# EAGLE design Becca Sap Flow Power Board MOD (EAGLE 9.6.2)
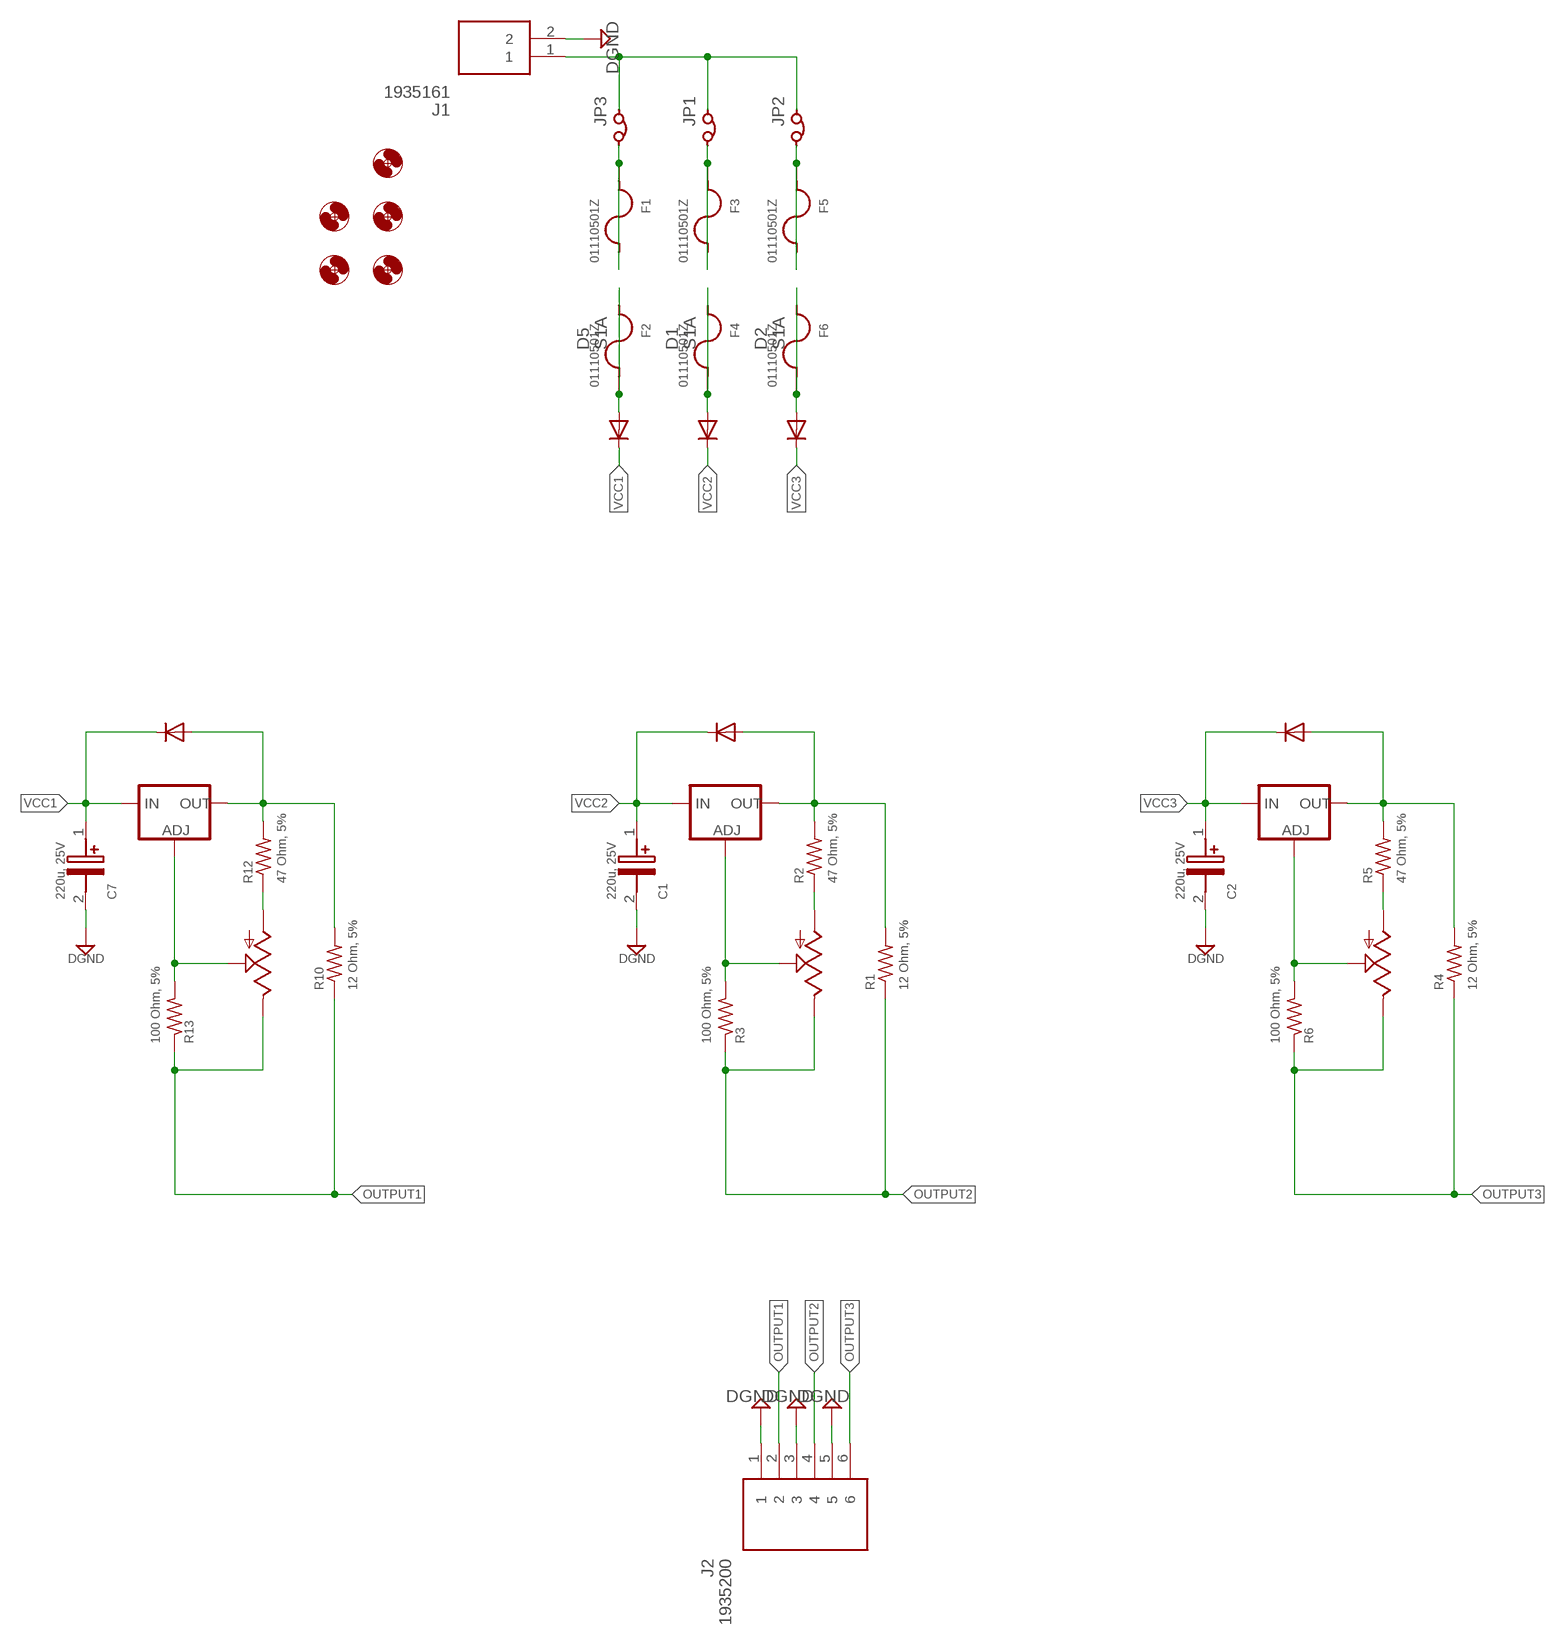
[diagram p0: schematic, sheet 1]

## Parts
C1  220u, 25V  UWT1E221MNL1GS  [CAPAE830X1080N]
C2  220u, 25V  UWT1E221MNL1GS  [CAPAE830X1080N]
C7  220u, 25V  UWT1E221MNL1GS  [CAPAE830X1080N]
D1  S1A  [DIOM5027X250N]
D2  S1A  [DIOM5027X250N]
D3  S1A  [DIOM5027X250N]
D4  S1A  [DIOM5027X250N]
D5  S1A  [DIOM5027X250N]
D6  S1A  [DIOM5027X250N]
F1  01110501Z  [01110501Z]
F2  01110501Z  [01110501Z]
F3  01110501Z  [01110501Z]
F4  01110501Z  [01110501Z]
F5  01110501Z  [01110501Z]
F6  01110501Z  [01110501Z]
J1  1935161  [1935161]
J2  1935200  [1935200]
JP1  JUMPER  [HDR2X1]
JP2  JUMPER  [HDR2X1]
JP3  JUMPER  [HDR2X1]
R1  12 Ohm, 5%  R-US_R1210  [R1210]
R2  47 Ohm, 5%  R-US_R1210  [R1210]
R3  100 Ohm, 5%  R-US_R1210  [R1210]
R4  12 Ohm, 5%  R-US_R1210  [R1210]
R5  47 Ohm, 5%  R-US_R1210  [R1210]
R6  100 Ohm, 5%  R-US_R1210  [R1210]
R10  12 Ohm, 5%  R-US_R1210  [R1210]
R12  47 Ohm, 5%  R-US_R1210  [R1210]
R13  100 Ohm, 5%  R-US_R1210  [R1210]
U1  LM317MBSTT3G  [SOT230P700X175-4N]
U2  LM317MBSTT3G  [SOT230P700X175-4N]
U3  LM317MBSTT3G  [SOT230P700X175-4N]
U$1  MOUNT-HOLE3.0  [3,0]
U$2  MOUNT-HOLE3.0  [3,0]
U$3  MOUNT-HOLE3.0  [3,0]
U$4  MOUNT-HOLE3.0  [3,0]
U$5  MOUNT-HOLE3.0  [3,0]
VR1  3296W-1-102RLF  [3296W1102RLF]
VR2  3296W-1-102RLF  [3296W1102RLF]
VR3  3296W-1-102RLF  [3296W1102RLF]

## Nets
DGND: C1.2(-) C2.2(-) C7.2(-) J1.2 J2.1 J2.3 J2.5
N$1: J1.1 JP1.1 JP2.1 JP3.1
N$2: D3.2(A) R1.2 R2.2 U2.2(OUT)
N$3: F1.1 F1.2 JP3.2
N$4: F3.1 F3.2 JP1.2
N$5: D5.2(A) F2.1 F2.2
N$6: D1.2(A) F4.1 F4.2
N$7: R3.2 U2.1(ADJ) VR2.2(S)
N$8: F5.1 F5.2 JP2.2
N$9: D2.2(A) F6.1 F6.2
N$10: R2.1 VR2.1(A)
N$11: D4.2(A) R4.2 R5.2 U3.2(OUT)
N$12: D6.2(A) R10.2 R12.2 U1.2(OUT)
N$13: R6.2 U3.1(ADJ) VR3.2(S)
N$14: R13.2 U1.1(ADJ) VR1.2(S)
N$15: R12.1 VR1.1(A)
N$16: R5.1 VR3.1(A)
OUTPUT1: J2.2 R10.1 R13.1 VR1.3(E)
OUTPUT2: J2.4 R1.1 R3.1 VR2.3(E)
OUTPUT3: J2.6 R4.1 R6.1 VR3.3(E)
VCC1: C7.1(+) D5.1(K) D6.1(K) U1.3(IN)
VCC2: C1.1(+) D1.1(K) D3.1(K) U2.3(IN)
VCC3: C2.1(+) D2.1(K) D4.1(K) U3.3(IN)

## Library data of the parts
C1 C2 C7 = Becca-Sap-Flow-LORA:UWT1E221MNL1GS: NICHICON - UWT1E221MNL1GS - ALUMINUM ELECTROLYTIC CAPACITOR 220UF 25V 20%, SMD Source: Datasheet <http://www.nichicon.co.jp/english/products/pdfs/e-uwt.pdf>; DESCRIPTION: NICHICON - UWT1E221MNL1GS - ALUMINUM ELECTROLYTIC CAPACITOR 220UF 25V 20%, SMD; HEIGHT: 10.8mm; MANUFACTURER_NAME: Nichicon; MANUFACTURER_PART_NUMBER: UWT1E221MNL1GS; MOUSER_PART_NUMBER: 647-UWT1E221MNL1GS; MOUSER_PRICE-STOCK: https://www.mouser.co.uk/ProductDetail/Nichicon/UWT1E221MNL1GS?qs=9nXXK2icEIxMJgFBHlqiZQ%3D%3D
D1-D6 = Becca-Sap-Flow-LORA:S1A: Rectifier Diode Switching 50V 1A 1500ns 2-Pin SMA T/R Source: Datasheet <https://diotec.com/request/datasheet/s1a.pdf>; DESCRIPTION: Rectifier Diode Switching 50V 1A 1500ns 2-Pin SMA T/R; HEIGHT: 2.5mm; MANUFACTURER_NAME: Diotec; MANUFACTURER_PART_NUMBER: S1A; MOUSER_PART_NUMBER: 637-S1A; MOUSER_PRICE-STOCK: https://www.mouser.co.uk/ProductDetail/Diotec-Semiconductor/S1A?qs=OlC7AqGiEDlqVjQP70PTqA%3D%3D
F1-F6 = Becca-Sap-Flow-LORA:01110501Z: Littelfuse 111 Spring Brass PCB Mount Fuse Clip for 2AG mm, 4.5 5 mm Cartridge Fuse Source: Datasheet <https://m.littelfuse.com/~/media/electronics/datasheets/fuse_clips/littelfuse_fuse_clip_111_datasheet.pdf.pdf>; DESCRIPTION: Littelfuse 111 Spring Brass PCB Mount Fuse Clip for 2AG mm, 4.5 5 mm Cartridge Fuse; HEIGHT: 7mm; MANUFACTURER_NAME: LITTELFUSE; MANUFACTURER_PART_NUMBER: 01110501Z; MOUSER_PART_NUMBER: 576-01110501Z; MOUSER_PRICE-STOCK: https://www.mouser.co.uk/ProductDetail/Littelfuse/01110501Z?qs=Ql%252B1sS8nYriZVK%2FyEjYMGg%3D%3D
J1 = Becca-Sap-Flow-LORA:1935161: Phoenix Contact COMBICON PT PCB Terminal Block, 2 Way/Pole, Screw Terminals, 26 14 AWG Through Hole, Nylon Source: Datasheet <https://datasheet.datasheetarchive.com/originals/distributors/SFDatasheet-2/sf-00057459.pdf>; DESCRIPTION: Phoenix Contact COMBICON PT PCB Terminal Block, 2 Way/Pole, Screw Terminals, 26 14 AWG Through Hole, Nylon; HEIGHT: 11.55mm; MANUFACTURER_NAME: Phoenix Contact; MANUFACTURER_PART_NUMBER: 1935161; MOUSER_PART_NUMBER: 651-1935161; MOUSER_PRICE-STOCK: https://www.mouser.co.uk/ProductDetail/Phoenix-Contact/1935161?qs=W3wJikR1%252BS6eKzfFl8Rbew%3D%3D
J2 = Becca-Sap-Flow-LORA:1935200: Fixed Terminal Blocks PT 1.5/6-5.0-H Source: Datasheet <https://datasheet.datasheetarchive.com/originals/distributors/SFDatasheet-2/sf-00057463.pdf>; DESCRIPTION: Fixed Terminal Blocks PT 1.5/6-5.0-H; HEIGHT: 11.55mm; MANUFACTURER_NAME: Phoenix Contact; MANUFACTURER_PART_NUMBER: 1935200; MOUSER_PART_NUMBER: 651-1935200; MOUSER_PRICE-STOCK: https://www.mouser.co.uk/ProductDetail/Phoenix-Contact/1935200?qs=8BCRtFWWXOTOyOTMiNRITA%3D%3D
JP1-JP3 = Becca-Sap-Flow-LORA:JUMPER: Wire jumper .1" C
R1-R6 R10 R12 R13 = Becca-Sap-Flow-LORA:R-US_: RESISTOR, American symbol; SPICEPREFIX: R
U1-U3 = Becca-Sap-Flow-LORA:LM317MBSTT3G: Internal Short Circuit Current Limiting; Internal Thermal Overload Protection; Output Current in Excess of 500 mA; Output Transistor Safe-Area Compensation; Output Adjustable between 1.2 V and 37 V; Floating Operation for High Voltage Applications; Eliminates Stocking Many Fixed Voltages; Pb-Free Packages are Available; NCV Prefix for Automotive and Other Applications Requiring Site Control Changes Source: Datasheet <https://www.onsemi.com/pub/Collateral/LM317M-D.PDF>; DESCRIPTION: Internal Short Circuit Current Limiting; Internal Thermal Overload Protection; Output Current in Excess of 500 mA; Output Transistor Safe-Area Compensation; Output Adjustable between 1.2 V and 37 V; Floating Operation for High Voltage Applications; Eliminates Stocking Many Fixed Voltages; Pb-Free Packages are Available; NCV Prefix for Automotive and Other Applications Requiring Site Control Changes; HEIGHT: 1.75mm; MANUFACTURER_NAME: onsemi; MANUFACTURER_PART_NUMBER: LM317MBSTT3G; MOUSER_PART_NUMBER: 863-LM317MBSTT3G; MOUSER_PRICE-STOCK: https://www.mouser.co.uk/ProductDetail/onsemi/LM317MBSTT3G?qs=2OtswVQKCOFxsFzIc5DGlw%3D%3D
U$1-U$5 = Becca-Sap-Flow-LORA:MOUNT-HOLE: MOUNTING HOLE with drill center marker
VR1-VR3 = Becca-Sap-Flow-LORA:3296W-1-102RLF: 1 kOhms 0.5W, 1/2W PC Pins Through Hole Trimmer Potentiometer Cermet 25.0 Turn Top Adjustment Source: Datasheet <https://www.bourns.com/docs/Product-Datasheets/3296.pdf>; DESCRIPTION: 1 kOhms 0.5W, 1/2W PC Pins Through Hole Trimmer Potentiometer Cermet 25.0 Turn Top Adjustment; HEIGHT: 11.8mm; MANUFACTURER_NAME: Bourns; MANUFACTURER_PART_NUMBER: 3296W-1-102RLF; MOUSER_PART_NUMBER: 652-3296W-1-102RLF; MOUSER_PRICE-STOCK: https://www.mouser.co.uk/ProductDetail/Bourns/3296W-1-102RLF?qs=oM%2FE6%2FUWOpR5bwX1MfrWeA%3D%3D

## Net classes
1 highpower: width 0.305 mm, drill 0.483 mm

## Board
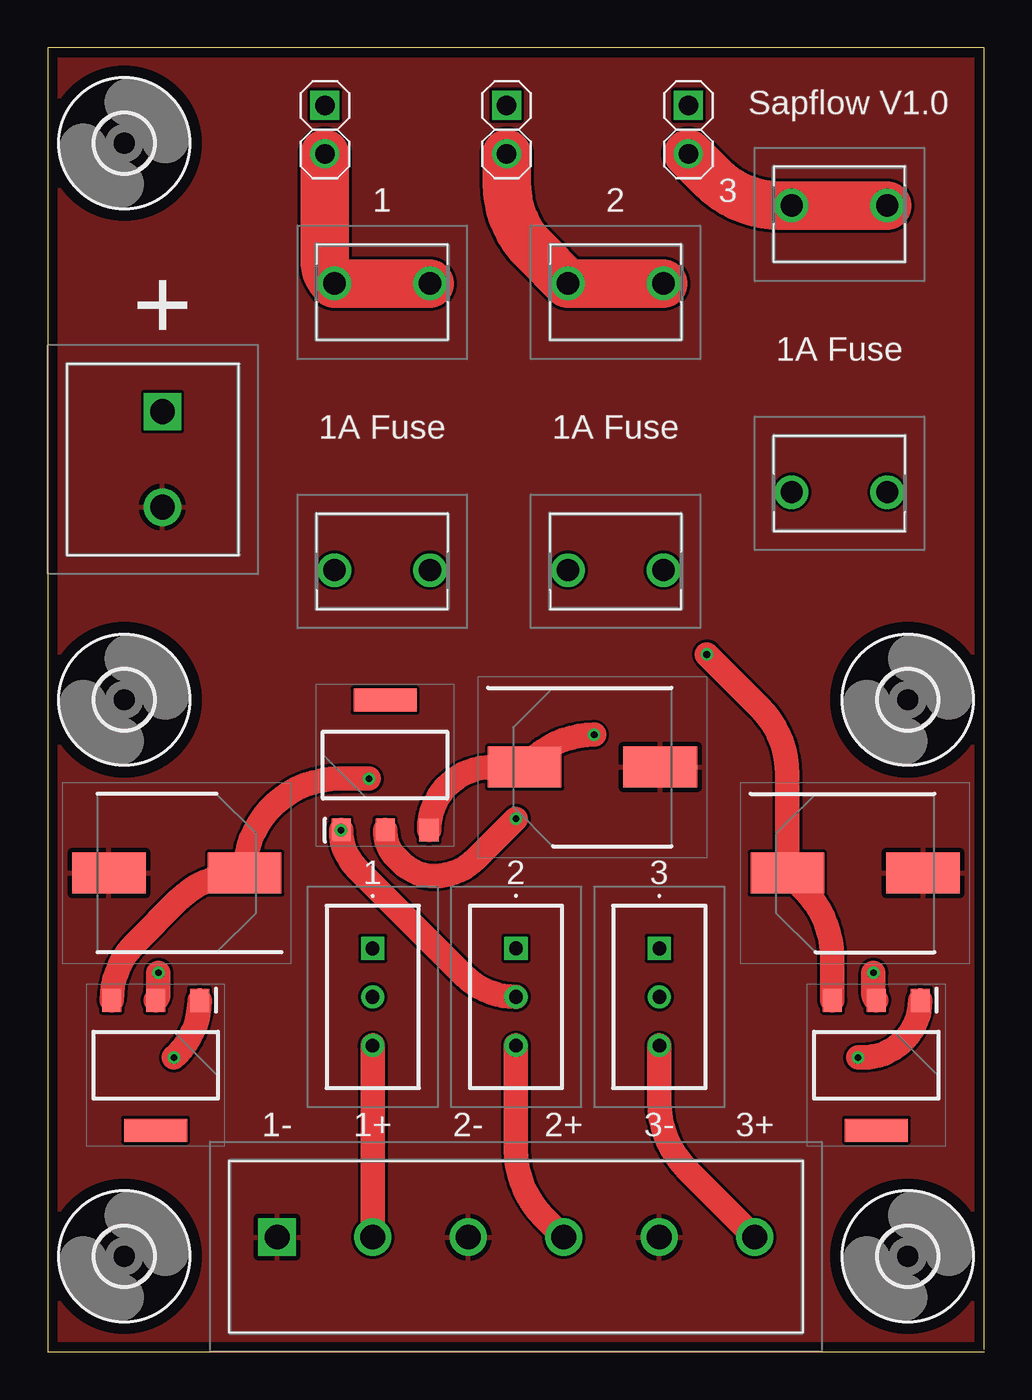
[diagram p1: board, top side]
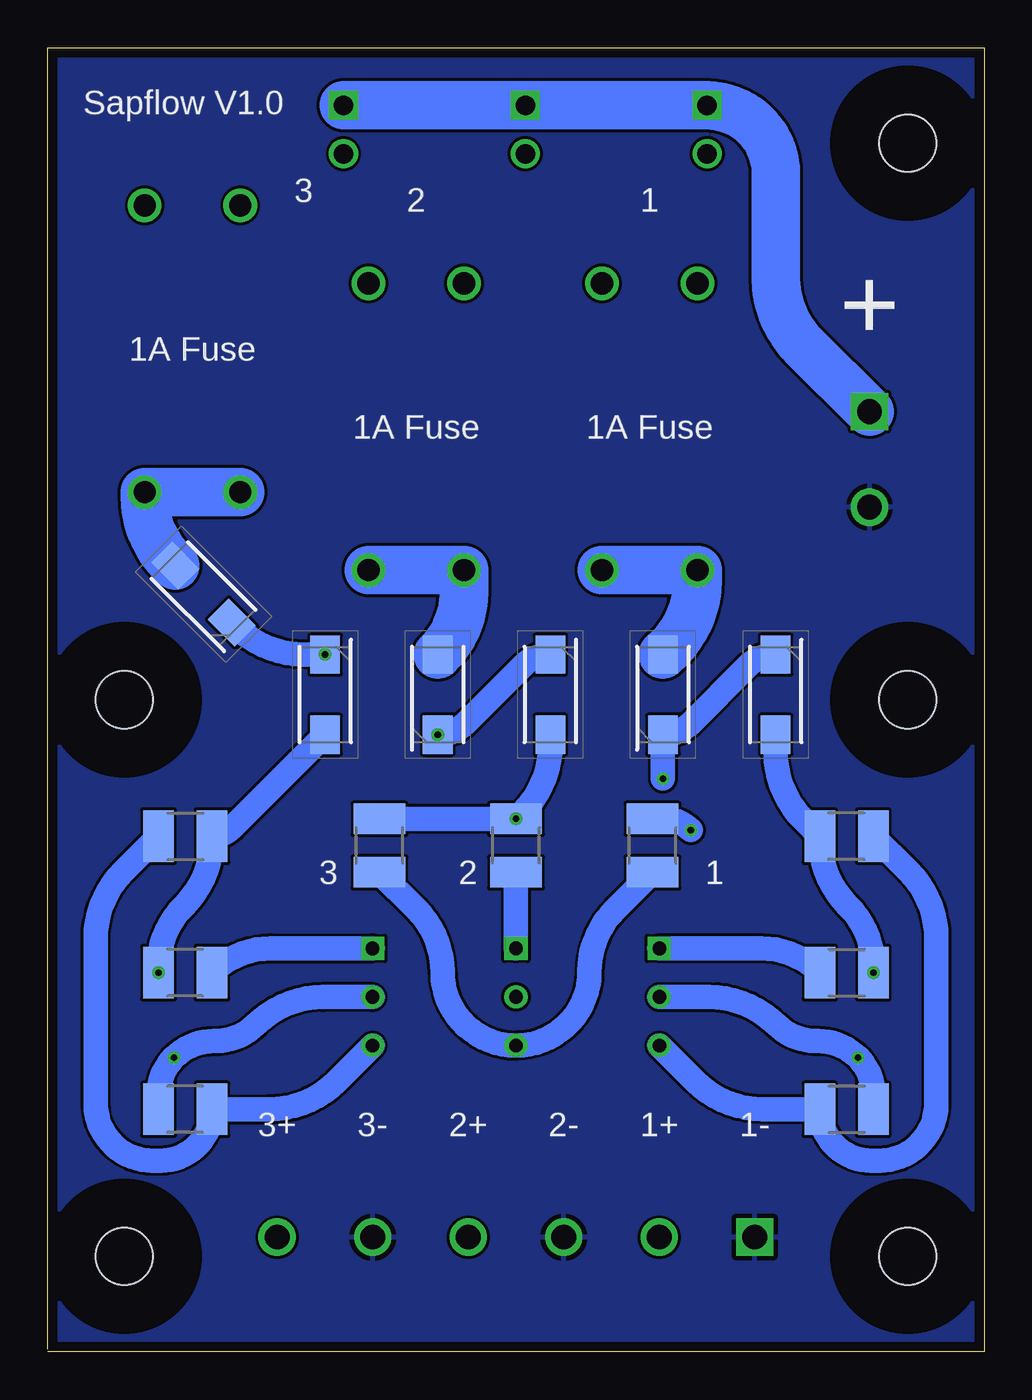
[diagram p2: board, bottom side, seen from below]

Size 49 x 68.26 mm. Coordinates in mm from the lower left corner, seen from the top.
Outline: 49,0 0,0 0,68.26 49,68.26 49,0.13
Copper layers (1*16): Top 0.035mm / dielectric 1.6mm / Bottom 0.035mm
Design rules "Elecrow_2-layer_PCB_eagle_rule": minimum track width 6mil, minimum drill 12mil, track to track 6mil, track to pad 6mil, pad to pad 6mil, via to via 8mil, smd to smd 0mil, copper to edge 20mil, drill to drill 10mil, minimum pad ring 6mil, minimum via ring 6mil, stop-mask expansion 0mil, vias tented up to drill 100mil, thermal gap 10mil

### Footprints (pad centres in the part's own frame; a part is rotated, then mirrored left to right if it is on the bottom)
CAPAE830X1080N = smd 3.85 x 2.15: 1 -3.55,0; 2 3.55,0
DIOM5027X250N = smd 2 x 1.55: 1 -2.1,0; 2 2.1,0
01110501Z = drill 1.17 pad 1.755: 1 0,0; 2 0,-5
1935161 = drill 1.3 pad 1.95 square: 1 0,0 | drill 1.3 pad 1.95: 2 5,0
1935200 = drill 1.3 pad 1.95 square: 1 0,0 | drill 1.3 pad 1.95: 2 5,0; 3 10,0; 4 15,0; 5 20,0; 6 25,0
HDR2X1 = drill 1.016 square: 1 0,0 | drill 1.016: 2 2.54,0
R1210 = smd 1.6 x 2.7: 1 -1.4,0; 2 1.4,0
SOT230P700X175-4N = smd 1.2 x 1: 1 -3.4,2.3; 2 -3.4,0; 3 -3.4,-2.3 | smd 1.2 x 3.3: 4 3.4,0
3,0 = hole 3: 0,0
3296W1102RLF = drill 0.71 pad 1.217 square: 1 0,0 | drill 0.71 pad 1.217: 2 0,2.54; 3 0,5.08

### Placement (x,y rotation side)
C1  28.5,30.61 0 top
C2  42.25,25.06 0 top
C7  6.75,25.06 180 top
D1  28.59,34.4 90 bottom
D2  40.85,39.66 135 bottom
D3  22.7,34.4 270 bottom
D4  34.49,34.4 270 bottom
D5  16.81,34.4 90 bottom
D6  10.91,34.4 270 bottom
F1  20,55.92 270 top
F2  15,40.92 90 top
F3  32.21,55.92 270 top
F4  27.21,40.92 90 top
F5  43.93,60 270 top
F6  38.93,45 90 top
J1  6,49.21 270 top
J2  12,6 0 top
JP1  24.01,65.25 270 top
JP2  33.52,65.25 270 top
JP3  14.5,65.25 270 top
R1  31.64,26.5 90 bottom
R2  24.5,26.5 90 bottom
R3  17.36,26.5 90 bottom
R4  41.81,26.99 0 bottom
R5  41.81,19.84 180 bottom
R6  41.81,12.7 180 bottom
R10  7.19,26.99 180 bottom
R12  7.19,19.84 0 bottom
R13  7.19,12.7 0 bottom
U1  5.65,15 270 top
U2  17.65,30.71 90 top
U3  43.35,15 270 top
U$1  45,5 0 top
U$2  45,34.13 0 top
U$3  4,5 0 top
U$4  4,63.26 0 top
U$5  4,34.13 0 top
VR1  17,21.11 180 top
VR2  24.5,21.11 180 top
VR3  32,21.11 180 top

### Tracks (layer width: path | path; a pad name or v marks a point on that pad's centre or on a via)
DGND
  pour Top (rank 3): 0,0 49,0 49,68.26 0,68.26
  pour Bottom (rank 3): 0,0 49,0 49,68.26 0,68.26
N$1
  Bottom 2.54: JP2.1 JP1.1 JP3.1 arc90 10.9,61.65 10.9,56.18 arc-45 9.44,52.65 J1.1
N$2  (via drill 0.35)
  Top 1.27: R2.2 22.39,25.8 arc-45 20.23,24.9 arc-45 18.47,25.63 18.25,25.84 arc-45 U2.2
  Bottom 1.27: R1.2 R2.2 24.16,28.24 arc-45 22.7,31.77 D3.2
  other vias: 24.5,27.9
N$3
  Top 2.54: JP3.2 14.5,57.12 arc45 F1.2 F1.1
N$4
  Top 2.54: JP1.2 24.01,61.19 arc45 25.48,57.66 F3.2 F3.1
N$5
  Bottom 2.54: D5.2 16.46,36.84 arc-45 15,40.38 F2.1 F2.2
N$6
  Bottom 2.54: F4.2 F4.1 27.21,39.83 arc45 D1.2
N$7  (via drill 0.35)
  Top 1.27: VR2.2 arc-45 21.75,19.71 16.2,25.26 arc-45 U2.1
  Bottom 1.27: U2.1 arc-45 16.78,27.9 R3.2
  other vias: 15.35,27.31
N$8
  Top 2.54: JP2.2 34.77,61.46 arc45 38.3,60 F5.2 F5.1
N$9
  Bottom 2.54: F6.1 F6.2 43.93,44.8 arc-45 42.46,41.27 D2.2
N$10
  Bottom 1.27: R2.1 VR2.1
N$11  (via drill 0.35)
  Top 1.27: U3.2 arc-45 43.21,18.76 R5.2
  Bottom 1.27: R5.2 43.21,20.13 arc45 41.87,23.35 arc-45 40.41,26.89 R4.2 arc-45 39.37,27.41 D4.2
  other vias: 43.21,19.84
N$12  (via drill 0.35)
  Top 1.27: R12.2 5.79,18.76 arc-45 U1.2
  Bottom 1.27: R12.2 5.79,20.13 arc-45 7.13,23.35 arc45 8.59,26.89 R10.2 9.45,27.84 arc45 10.91,31.38 D6.2
  other vias: 5.79,19.84
N$13  (via drill 0.35)
  Top 1.27: v42.4,15.4 42.66,15.4 arc90 U3.1
  Bottom 1.27: VR3.2 34.6,18.57 arc-45 38.13,17.11 arc45 40.16,16.27 40.3,16.27 arc-45 v42.4,15.4 arc-45 43.21,13.45 R6.2
N$14  (via drill 0.35)
  Top 1.27: v6.6,15.4 6.78,15.57 arc45 U1.1
  Bottom 1.27: VR1.2 14.4,18.57 arc45 10.87,17.11 arc-45 8.84,16.27 8.7,16.27 arc45 v6.6,15.4 arc45 5.79,13.45 R13.2
N$15
  Bottom 1.27: R12.1 arc-45 11.66,21.11 VR1.1
N$16
  Bottom 1.27: R5.1 arc45 37.34,21.11 VR3.1
OUTPUT1
  Top 1.27: VR1.3 J2.2
  Bottom 1.27: R10.1 3.96,25.16 arc45 2.5,21.62 2.5,13 arc90 5.5,10 5.89,10 arc90 R13.1 11.59,12.7 arc45 15.13,14.16 VR1.3
OUTPUT2
  Top 1.27: VR2.3 24.5,10.57 arc45 25.96,7.04 J2.4
  Bottom 1.27: R3.1 19.3,23.16 arc-45 20.66,19.88 arc90 VR2.3 arc90 28.34,19.88 arc-45 29.7,23.16 R1.1
OUTPUT3
  Top 1.27: VR3.3 32,13.07 arc45 33.46,9.54 J2.6
  Bottom 1.27: VR3.3 33.87,14.16 arc45 37.41,12.7 R6.1 arc90 43.1,10 43.5,10 arc90 46.5,13 46.5,21.62 arc45 45.04,25.16 R4.1
VCC1  (via drill 0.35)
  Top 1.27: v16.81,30 15.24,30 arc90 C7.1 arc45 6.81,23.61 4.58,21.38 arc45 U1.3
  Bottom 1.27: D6.1 arc-45 12.36,35.9 15.36,32.9 arc45 D5.1 v16.81,30
VCC2  (via drill 0.35)
  Top 1.27: D1.1 arc45 25.27,30.92 C1.1 23.25,30.61 arc90 U2.3
  Bottom 1.27: D1.1 arc-45 27.15,32.9 24.14,35.9 arc45 D3.1
  other vias: 28.59,32.3
VCC3  (via drill 0.35)
  Top 1.27: D4.1 37.24,33.75 arc-45 38.7,30.21 C2.1 39.58,24.18 arc-45 41.04,20.64 41.04,18.41 U3.3
  Bottom 1.27: D4.1 35.62,36.5 arc45 39.16,37.96 D2.1
  other vias: 34.49,36.5

### Text on the board
tPlace: Sapflow V1.0 | 3 | 1 | 2 | + | 1A Fuse | 1A Fuse | 1A Fuse | 1 | 2 | 3 | 1- | 1+ | 2- | 2+ | 3- | 3+
bPlace: Sapflow V1.0 | 3 | 1 | 2 | + | 1A Fuse | 1A Fuse | 1A Fuse | 1 | 2 | 3 | 1- | 1+ | 2- | 2+ | 3- | 3+